# Altium project BMS_SLAVE.PrjPcb
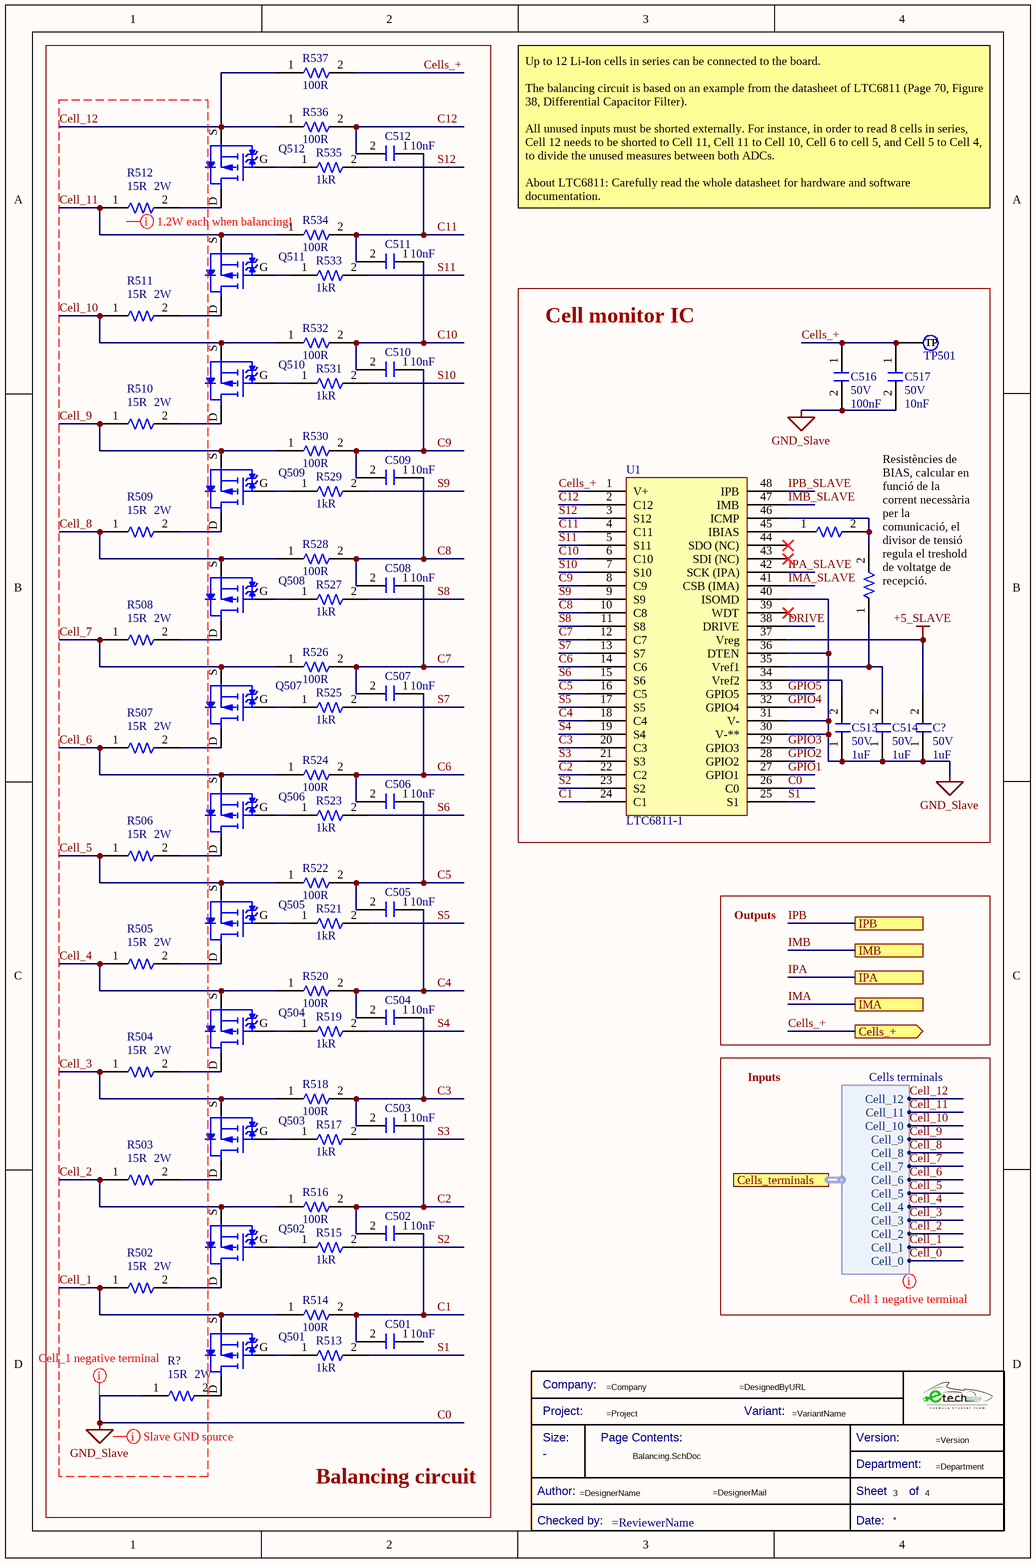
[diagram p0: Balancing.SchDoc]
2 sheets, 103 parts. Net scope: flat (ports and power ports of the same name join across sheets).
Sheets:
  Balancing.SchDoc
  Temperatures.SchDoc

## Sheet Balancing.SchDoc
size A4 portrait; DocumentNumber: 6; SheetNumber: 3; SheetTotal: 4

### Parts
(Parts that share a designator on the sheet are numbered #1, #2 ... from top to bottom, then left to right.)
*  Title Block_template  (value not drawn)  (graphical)
?#1  ERJ-8GEYJ112V  [R1206FTK-W]  (value not drawn)
?#2  ERJ-8GEYJ112V  [R1206FTK-W]  (value not drawn)
C501  Capacitance: 10nF  [C0805FNPC-R]  (hidden comment: 885012207092)
C502  Capacitance: 10nF  [C0805FNPC-R]  (hidden comment: 885012207092)
C503  Capacitance: 10nF  [C0805FNPC-R]  (hidden comment: 885012207092)
C504  Capacitance: 10nF  [C0805FNPC-R]  (hidden comment: 885012207092)
C505  Capacitance: 10nF  [C0805FNPC-R]  (hidden comment: 885012207092)
C506  Capacitance: 10nF  [C0805FNPC-R]  (hidden comment: 885012207092)
C507  Capacitance: 10nF  [C0805FNPC-R]  (hidden comment: 885012207092)
C508  Capacitance: 10nF  [C0805FNPC-R]  (hidden comment: 885012207092)
C509  Capacitance: 10nF  [C0805FNPC-R]  (hidden comment: 885012207092)
C510  Capacitance: 10nF  [C0805FNPC-R]  (hidden comment: 885012207092)
C511  Capacitance: 10nF  [C0805FNPC-R]  (hidden comment: 885012207092)
C512  Capacitance: 10nF  [C0805FNPC-R]  (hidden comment: 885012207092)
C513  Voltage Rating: 50V  Capacitance: 1uF  [C0805FNPC-R]  (hidden comment: 885012207103)
C514  Voltage Rating: 50V  Capacitance: 1uF  [C0805FNPC-R]  (hidden comment: 885012207103)
C516  Voltage Rating: 50V  Capacitance: 100nF  [C0805FNPC-R]  (hidden comment: 885012207098)
C517  Voltage Rating: 50V  Capacitance: 10nF  [C0805FNPC-R]  (hidden comment: 885012207092)
C?#1  Voltage Rating: 50V  Capacitance: 1uF  [C0805FNPC-R]  (hidden comment: 885012207103)
Q501  BSS308PE  [TRT-PCH-2/30-BSS]  (value not drawn)
Q502  BSS308PE  [TRT-PCH-2/30-BSS]  (value not drawn)
Q503  BSS308PE  [TRT-PCH-2/30-BSS]  (value not drawn)
Q504  BSS308PE  [TRT-PCH-2/30-BSS]  (value not drawn)
Q505  BSS308PE  [TRT-PCH-2/30-BSS]  (value not drawn)
Q506  BSS308PE  [TRT-PCH-2/30-BSS]  (value not drawn)
Q507  BSS308PE  [TRT-PCH-2/30-BSS]  (value not drawn)
Q508  BSS308PE  [TRT-PCH-2/30-BSS]  (value not drawn)
Q509  BSS308PE  [TRT-PCH-2/30-BSS]  (value not drawn)
Q510  BSS308PE  [TRT-PCH-2/30-BSS]  (value not drawn)
Q511  BSS308PE  [TRT-PCH-2/30-BSS]  (value not drawn)
Q512  BSS308PE  [TRT-PCH-2/30-BSS]  (value not drawn)
R502  value 15R  Max Power Dissipation: 2W  [R2512FTK]  (hidden comment: 352115RFT)
R503  value 15R  Max Power Dissipation: 2W  [R2512FTK]  (hidden comment: 352115RFT)
R504  value 15R  Max Power Dissipation: 2W  [R2512FTK]  (hidden comment: 352115RFT)
R505  value 15R  Max Power Dissipation: 2W  [R2512FTK]  (hidden comment: 352115RFT)
R506  value 15R  Max Power Dissipation: 2W  [R2512FTK]  (hidden comment: 352115RFT)
R507  value 15R  Max Power Dissipation: 2W  [R2512FTK]  (hidden comment: 352115RFT)
R508  value 15R  Max Power Dissipation: 2W  [R2512FTK]  (hidden comment: 352115RFT)
R509  value 15R  Max Power Dissipation: 2W  [R2512FTK]  (hidden comment: 352115RFT)
R510  value 15R  Max Power Dissipation: 2W  [R2512FTK]  (hidden comment: 352115RFT)
R511  value 15R  Max Power Dissipation: 2W  [R2512FTK]  (hidden comment: 352115RFT)
R512  value 15R  Max Power Dissipation: 2W  [R2512FTK]  (hidden comment: 352115RFT)
R513  Resistance: 1kR  [R0805FTK]  (hidden comment: CR0805-JW-102ELF)
R514  Resistance: 100R  [R0805FTK]  (hidden comment: CR0805-FX-1000ELF)
R515  Resistance: 1kR  [R0805FTK]  (hidden comment: CR0805-JW-102ELF)
R516  Resistance: 100R  [R0805FTK]  (hidden comment: CR0805-FX-1000ELF)
R517  Resistance: 1kR  [R0805FTK]  (hidden comment: CR0805-JW-102ELF)
R518  Resistance: 100R  [R0805FTK]  (hidden comment: CR0805-FX-1000ELF)
R519  Resistance: 1kR  [R0805FTK]  (hidden comment: CR0805-JW-102ELF)
R520  Resistance: 100R  [R0805FTK]  (hidden comment: CR0805-FX-1000ELF)
R521  Resistance: 1kR  [R0805FTK]  (hidden comment: CR0805-JW-102ELF)
R522  Resistance: 100R  [R0805FTK]  (hidden comment: CR0805-FX-1000ELF)
R523  Resistance: 1kR  [R0805FTK]  (hidden comment: CR0805-JW-102ELF)
R524  Resistance: 100R  [R0805FTK]  (hidden comment: CR0805-FX-1000ELF)
R525  Resistance: 1kR  [R0805FTK]  (hidden comment: CR0805-JW-102ELF)
R526  Resistance: 100R  [R0805FTK]  (hidden comment: CR0805-FX-1000ELF)
R527  Resistance: 1kR  [R0805FTK]  (hidden comment: CR0805-JW-102ELF)
R528  Resistance: 100R  [R0805FTK]  (hidden comment: CR0805-FX-1000ELF)
R529  Resistance: 1kR  [R0805FTK]  (hidden comment: CR0805-JW-102ELF)
R530  Resistance: 100R  [R0805FTK]  (hidden comment: CR0805-FX-1000ELF)
R531  Resistance: 1kR  [R0805FTK]  (hidden comment: CR0805-JW-102ELF)
R532  Resistance: 100R  [R0805FTK]  (hidden comment: CR0805-FX-1000ELF)
R533  Resistance: 1kR  [R0805FTK]  (hidden comment: CR0805-JW-102ELF)
R534  Resistance: 100R  [R0805FTK]  (hidden comment: CR0805-FX-1000ELF)
R535  Resistance: 1kR  [R0805FTK]  (hidden comment: CR0805-JW-102ELF)
R536  Resistance: 100R  [R0805FTK]  (hidden comment: CR0805-FX-1000ELF)
R537  Resistance: 100R  [R0805FTK]  (hidden comment: CR0805-FX-1000ELF)
R?#1  value 15R  Max Power Dissipation: 2W  [R2512FTK]  (hidden comment: 352115RFT)
TP501  TestPoint  [TestPoint]  (value not drawn)  (no BOM)
U1  LTC6811-1  [U_LTC6811G-2]

### Blocks framed on the sheet
Balancing circuit: C501-C512 Q501-Q512 R502-R537 R?#1
Cell monitor IC: ?#1 ?#2 C513 C514 C516 C517 C?#1 TP501 U1

### Ports
Cells_+ (out), Cells_terminals (harness Cells terminals), IMA, IMB, IPA, IPB

### Harnesses
Cells terminals: Cell_0, Cell_1, Cell_2, Cell_3, Cell_4, Cell_5, Cell_6, Cell_7, Cell_8, Cell_9, Cell_10, Cell_11, Cell_12

### Nets
+5_SLAVE: C?#1.2 U1.37(Vreg)
C0: C513.1 C514.1 C516.2 C517.2 C?#1.1 R?#1.1 U1.26(C0) U1.30(V-**) U1.31(V-) U1.36(DTEN) U1.40(ISOMD)  [also labelled GND_Slave]
C1: C501.2 C502.1 R514.2 U1.24(C1)
C2: C502.2 C503.1 R516.2 U1.22(C2)
C3: C503.2 C504.1 R518.2 U1.20(C3)
C4: C504.2 C505.1 R520.2 U1.18(C4)
C5: C505.2 C506.1 R522.2 U1.16(C5)
C6: C506.2 C507.1 R524.2 U1.14(C6)
C7: C507.2 C508.1 R526.2 U1.12(C7)
C8: C508.2 C509.1 R528.2 U1.10(C8)
C9: C509.2 C510.1 R530.2 U1.8(C9)
C10: C510.2 C511.1 R532.2 U1.6(C10)
C11: C511.2 C512.1 R534.2 U1.4(C11)
C12: C512.2 R536.2 U1.2(C12)
Cell_0: port Cells_terminals.Cell_0
Cell_1: Q501.S R502.1 R514.1 ; port Cells_terminals.Cell_1
Cell_2: Q502.S R503.1 R516.1 ; port Cells_terminals.Cell_2
Cell_3: Q503.S R504.1 R518.1 ; port Cells_terminals.Cell_3
Cell_4: Q504.S R505.1 R520.1 ; port Cells_terminals.Cell_4
Cell_5: Q505.S R506.1 R522.1 ; port Cells_terminals.Cell_5
Cell_6: Q506.S R507.1 R524.1 ; port Cells_terminals.Cell_6
Cell_7: Q507.S R508.1 R526.1 ; port Cells_terminals.Cell_7
Cell_8: Q508.S R509.1 R528.1 ; port Cells_terminals.Cell_8
Cell_9: Q509.S R510.1 R530.1 ; port Cells_terminals.Cell_9
Cell_10: Q510.S R511.1 R532.1 ; port Cells_terminals.Cell_10
Cell_11: Q511.S R512.1 R534.1 ; port Cells_terminals.Cell_11
Cell_12: Q512.S R536.1 R537.1 ; port Cells_terminals.Cell_12
Cells_+: C516.1 C517.1 R537.2 TP501.1(TP) U1.1(V+) ; port Cells_+
DRIVE: U1.38(DRIVE)
GPIO1: U1.27(GPIO1)
GPIO2: U1.28(GPIO2)
GPIO3: U1.29(GPIO3)
GPIO4: U1.32(GPIO4)
GPIO5: U1.33(GPIO5)
IMA: port IMA
IMA_SLAVE: U1.41(CSB_(IMA))
IMB: port IMB
IMB_SLAVE: U1.47(IMB)
IPA: port IPA
IPA_SLAVE: U1.42(SCK_(IPA))
IPB: port IPB
IPB_SLAVE: U1.48(IPB)
S1: R513.2 U1.25(S1)
S2: R515.2 U1.23(S2)
S3: R517.2 U1.21(S3)
S4: R519.2 U1.19(S4)
S5: R521.2 U1.17(S5)
S6: R523.2 U1.15(S6)
S7: R525.2 U1.13(S7)
S8: R527.2 U1.11(S8)
S9: R529.2 U1.9(S9)
S10: R531.2 U1.7(S10)
S11: R533.2 U1.5(S11)
S12: R535.2 U1.3(S12)
Net?#1_1: ?#1.1 U1.45(IBIAS)
Net?#1_2: ?#1.2 ?#2.2 U1.46(ICMP)
Net?#2_1: ?#2.1 C514.2 U1.35(Vref1)
NetC513_2: C513.2 U1.34(Vref2)
NetQ501_D: Q501.D R?#1.2
NetQ501_G: Q501.G R513.1
NetQ502_D: Q502.D R502.2
NetQ502_G: Q502.G R515.1
NetQ503_D: Q503.D R503.2
NetQ503_G: Q503.G R517.1
NetQ504_D: Q504.D R504.2
NetQ504_G: Q504.G R519.1
NetQ505_D: Q505.D R505.2
NetQ505_G: Q505.G R521.1
NetQ506_D: Q506.D R506.2
NetQ506_G: Q506.G R523.1
NetQ507_D: Q507.D R507.2
NetQ507_G: Q507.G R525.1
NetQ508_D: Q508.D R508.2
NetQ508_G: Q508.G R527.1
NetQ509_D: Q509.D R509.2
NetQ509_G: Q509.G R529.1
NetQ510_D: Q510.D R510.2
NetQ510_G: Q510.G R531.1
NetQ511_D: Q511.D R511.2
NetQ511_G: Q511.G R533.1
NetQ512_D: Q512.D R512.2
NetQ512_G: Q512.G R535.1

Not connected (* = marked no-connect by the designer): C501 1; U1 39(WDT)* 43(SDI_(NC))* 44(SDO_(NC))*

### Layout directives
mark named Cell 1 negative terminal: Cell_0
mark named Slave GND source: Cell_1, Cell_2, Cell_3, Cell_4, Cell_5, Cell_6, Cell_7, Cell_8, Cell_9, Cell_10, Cell_11, Cell_12, GND_Slave
mark named 1.2W each when balancing!: Cell_1, Cell_2, Cell_3, Cell_4, Cell_5, Cell_6, Cell_7, Cell_8, Cell_9, Cell_10, Cell_11, Cell_12, GND_Slave
mark named Cell_1 negative terminal: C0

### Notes on the sheet
- Up to 12 Li-Ion cells in series can be connected to the board.
  The balancing circuit is based on an example from the datasheet of LTC6811 (Page 70, Figure 38, Differential Capacitor Filter).
  All unused inputs must be shorted externally. For instance, in order to read 8 cells in series, Cell 12 needs to be shorted to Cell 11, Cell 11 to Cell 10, Cell 6 to cell 5, and Cell 5 to Cell 4, to divide the unused measures between both ADCs.
  About LTC6811: Carefully read the whole datasheet for hardware and software documentation.
- Resistències de BIAS, calcular en funció de la corrent necessària per la comunicació, el divisor de tensió regula el treshold de voltatge de recepció.
- Outputs
- Inputs
- Title
- Size:
- Date:
- A4
- Number:
- Time:
- Revision:
- Sheet
- of
- File:
- (in symbol Title Block_template) Company:; Project:; Variant:; Size:; Page Contents:; Version:; Department:; Author:; Sheet; of; Checked by:; Date:

### Library data of the parts
* = Title Block_template: Standard Title Block; Category: Title Block; Checked by:: =ReviewerName; Size: -
?#1 ?#2 = R1k1-1206FTK: Res Thick Film 1206 1.1K Ohm 5% 0.25W ±200ppm/°C Molded SMD Punched Carrier T/R; Manufacturer: Panasonic; Power Rating: 250mW; Voltage Rating: 200V; .Creator: DO; Supplier 1: Newark; Manufacturer Part Number: ERJ-8GEYJ112V; RoHS: Yes; Category: Chip SMD Resistors; Stock 1: 9980; Pricing 1: 10=0,12700, 25=0,10100, 50=0,07500, 100=0,05000 (USD); Mount: Surface Mount; Case/Package: 1206; Contact Plating: Tin; Case Code (Metric): 3216; Case Code (Imperial): 1206; Min Operating Temperature: -55°C; Max Operating Temperature: 155°C; Tolerance: 5%; Resistor Type: Thick Film; Temperature Coefficient: 200ppm/°C; Packaging: Tape and Reel; Package Quantity: 1; Number of Terminations: 2; Max Power Dissipation: 250mW; Voltage Rating (DC): 200V; Features: Automotive AEC-Q200; Series: ERJ; Resistance Tolerance: 5%; Construction: Rectangular; Length: 3.2mm; Width: 0.063inch; Height: 0.028inch; Depth: 1.6mm; Radiation Hardening: No; REACH SVHC: No SVHC; Military Standard: Not; Lead Free: Lead Free; RoHS Compliant: Yes; ComponentLink1URL: https://datasheet.ciiva.com/5868/1500035-5868231.pdf?src-supplier=Farnell; ComponentLink1Description: https://datasheet.ciiva.com/5868/1500035-5868231.pdf?src-supplier=Farnell; ComponentLink2URL: https://datasheet.ciiva.com/17215/aoa0000ce1-17215127.pdf?src-supplier=Avnet+Europe; ComponentLink2Description: https://datasheet.ciiva.com/17215/aoa0000ce1-17215127.pdf?src-supplier=Avnet+Europe; ComponentLink3URL: https://datasheet.ciiva.com/46387/1500035-46387306.pdf?src-supplier=Element14; ComponentLink3Description: https://datasheet.ciiva.com/46387/1500035-46387306.pdf?src-supplier=Element14; ComponentLink4URL: https://datasheet.ciiva.com/9198/aoa0000ce1-9198847.pdf?src-supplier=Avnet; ComponentLink4Description: https://datasheet.ciiva.com/9198/aoa0000ce1-9198847.pdf?src-supplier=Avnet; Supplier Part Number 1: 63W1481; ComponentLink5Description: Where buy it; ComponentLink5URL: https://www.mouser.es/ProductDetail/Panasonic/ERJ-8GEYJ112V?qs=1VWA5LkbEaqqGx1BXqOkLA%3D%3D
C501-C512 C517 = C10n-50V-0805FNPC-X7R: Cap, 0.01ΜF, 50V, 10%, X7R, 0805; Manufacturer 1: Wurth Electronics; .Creator: DR; Supplier 1: RSComponents; Manufacturer Part Number 1: 885012207092; RoHS: Yes; Category: Ceramic Capacitors; Stock 1: 1; Pricing 1: 4000=0,03200, 12000=0,03100 (USD); Mount: Surface Mount; Case/Package: 0805; Case Code (Metric): 2012; Case Code (Imperial): 0805; Min Operating Temperature: -55°C; Max Operating Temperature: 125°C; Packaging: Cut Tape; Dielectric: X7R; Tolerance: 10%; Voltage Rating (DC): 50V; Length: 0.079inch; Width: 0.049inch; Thickness: 0.035inch; REACH SVHC: Unknown; RoHS Compliant: Yes; ComponentLink1URL: http://www.farnell.com/datasheets/1958497.pdf?src-supplier=Farnell; ComponentLink1Description: http://www.farnell.com/datasheets/1958497.pdf?src-supplier=Farnell; ComponentLink2URL: http://www.farnell.com/datasheets/1958497.pdf?src-supplier=Element14; ComponentLink2Description: http://www.farnell.com/datasheets/1958497.pdf?src-supplier=Element14; ComponentLink3URL: http://www.farnell.com/datasheets/1958497.pdf?src-supplier=Newark; ComponentLink3Description: http://www.farnell.com/datasheets/1958497.pdf?src-supplier=Newark; ComponentLink4URL: https://katalog.we-online.de/pbs/datasheet/885012207092.pdf?src-supplier=Digi-Key; ComponentLink4Description: https://katalog.we-online.de/pbs/datasheet/885012207092.pdf?src-supplier=Digi-Key; Supplier Part Number 1: 1813941
  C501-C512: Voltage Rating: 50V
C513 C514 C?#1 = C1u-50V-0805FNPC-X7R: Multilayer Ceramic Capacitor, Wcap-Csgp Series, 1 F, 10%, X7R, 50 V, 0805 [2012 Metric] Rohs Compliant: Yes; Manufacturer 1: Wurth Electronics; .Creator: GP; Supplier 1: RSComponents; Manufacturer Part Number 1: 885012207103; RoHS: Yes; Category: Ceramic Capacitors; Stock 1: 5100; Pricing 1: 50=0,27200, 250=0,25300, 500=0,22800, 1250=0,20100, 2500=0,17100 (GBP); Mount: Surface Mount; Case/Package: 0805; Case Code (Metric): 2012; Case Code (Imperial): 0805; Min Operating Temperature: -55°C; Max Operating Temperature: 85°C; Packaging: Cut Tape; Dielectric: X7R; Tolerance: 10%; Voltage Rating (DC): 50V; Length: 0.079inch; Width: 0.049inch; Thickness: 0.053inch; REACH SVHC: Unknown; RoHS Compliant: Yes; ComponentLink1URL: http://www.farnell.com/datasheets/1958501.pdf?src-supplier=Farnell; ComponentLink1Description: http://www.farnell.com/datasheets/1958501.pdf?src-supplier=Farnell; ComponentLink2URL: http://www.farnell.com/datasheets/1958501.pdf?src-supplier=Element14; ComponentLink2Description: http://www.farnell.com/datasheets/1958501.pdf?src-supplier=Element14; ComponentLink3URL: https://katalog.we-online.de/pbs/datasheet/885012107003.pdf?src-supplier=Digi-Key; ComponentLink3Description: https://katalog.we-online.de/pbs/datasheet/885012107003.pdf?src-supplier=Digi-Key; ComponentLink4URL: http://www.farnell.com/datasheets/1958501.pdf?src-supplier=Newark; ComponentLink4Description: http://www.farnell.com/datasheets/1958501.pdf?src-supplier=Newark; Supplier Part Number 1: 1813523
C516 = C100n-50V-0805FNPC-X7R: Cap, 0.1ΜF, 50V, 10%, X7R, 0805; Manufacturer 1: Wurth Electronics; .Creator: DR; Supplier 1: RSComponents; Manufacturer Part Number 1: 885012207098; RoHS: Yes; Category: Ceramic Capacitors; Stock 1: 8000; Pricing 1: 100=0,10200, 500=0,07100, 2000=0,06100 (GBP); Mount: Surface Mount; Case/Package: 0805; Case Code (Metric): 2012; Case Code (Imperial): 0805; Min Operating Temperature: -55°C; Max Operating Temperature: 125°C; Packaging: Cut Tape; Dielectric: X7R; Tolerance: 10%; Voltage Rating (DC): 50V; Length: 0.079inch; Width: 0.049inch; Thickness: 0.035inch; REACH SVHC: Unknown; RoHS Compliant: Yes; ComponentLink1URL: http://www.farnell.com/datasheets/1958498.pdf?src-supplier=Farnell; ComponentLink1Description: http://www.farnell.com/datasheets/1958498.pdf?src-supplier=Farnell; ComponentLink2URL: http://www.farnell.com/datasheets/1958498.pdf?src-supplier=Element14; ComponentLink2Description: http://www.farnell.com/datasheets/1958498.pdf?src-supplier=Element14; ComponentLink3URL: https://katalog.we-online.de/pbs/datasheet/885012207098.pdf?src-supplier=Digi-Key; ComponentLink3Description: https://katalog.we-online.de/pbs/datasheet/885012207098.pdf?src-supplier=Digi-Key; ComponentLink4URL: http://www.farnell.com/datasheets/1958498.pdf?src-supplier=Newark; ComponentLink4Description: http://www.farnell.com/datasheets/1958498.pdf?src-supplier=Newark; Supplier Part Number 1: 1813493
Q501-Q512 = TRT-PCH-2/30-BSS: Infineon’s highly innovative OptiMOS™ families include p-channel power MOSFETs, SOT-23-3, RoHS; Manufacturer Part Number: BSS308PEH6327; Continuous Drain Current (ID): 2A; Input Capacitance: 500pF; Drain to Source Voltage (Vdss): 30V; Max Power Dissipation: 500mW; Gate to Source Voltage (Vgs): 20V; Rds On Max: 80mR; Rise Time: 7.7ns; Turn-Off Delay Time: 15.3ns; Fall Time: 2.8ns; Turn-On Delay Time: 5.6ns; Threshold Voltage: -1.5V; .Creator: DO; Supplier 1: RSComponents; Manufacturer: Infineon; RoHS: Yes; Category: MOSFETs; Stock 1: 4000; Pricing 1: 50=0,50300, 100=0,26400, 250=0,25900, 500=0,25200, 1000=0,24700 (USD); Mount: Surface Mount; Case/Package: TO-236-3; Number of Pins: 3; Min Operating Temperature: -55°C; Max Operating Temperature: 150°C; Packaging: Tape and Reel; Package Quantity: 1; Series: OptiMOS™; REACH SVHC: No SVHC; ComponentLink1URL: https://datasheet.ciiva.com/6379/infineon-bss308pe-ds-v02-03-en-6379920.pdf?src-supplier=Digi-Key; ComponentLink1Description: datasheet; ComponentLink2URL: https://datasheet.ciiva.com/11171/infineon-bss308pe-ds-v02-03-en-11171385.pdf?src-supplier=Avnet; ComponentLink2Description: https://datasheet.ciiva.com/11171/infineon-bss308pe-ds-v02-03-en-11171385.pdf?src-supplier=Avnet; Supplier Part Number 1: 8235500
R502-R512 R?#1 = R15-2512FTK: Res Thick Film 2512 15 Ohm 1% 2W ±100ppm/C Pad SMD T/R; Manufacturer 1: TE Connectivity; Temperature Coefficient: 100ppm/°C; Voltage Rating: 250V; Number of Resistors: 1; .Creator: DR; ComponentLink1Description: Datasheet; ComponentLink1URL: https://docs.rs-online.com/8bc1/0900766b81096b90.pdf; ComponentLink2Description: Where buy it; ComponentLink2URL: https://es.rs-online.com/web/p/resistencias-de-montaje-en-superficie/7551110; Supplier 1: RSComponents; Manufacturer Part Number 1: 352115RFT; RoHS: Yes; Category: Chip SMD Resistors; Stock 1: 1; Pricing 1: 10=0,64300, 250=0,62200, 1000=0,60000, 2000=0,55400, 2500=0,52100 (USD); Mount: Surface Mount; Case/Package: 2512; Case Code (Metric): 6432; Case Code (Imperial): 2512; Min Operating Temperature: -55°C; Max Operating Temperature: 155°C; Packaging: Tape and Reel; Tolerance: 1%; Resistor Type: Thick Film,Power resistor; Number of Terminations: 2; Termination: Solder; Voltage Rating (DC): 250V; Features: Automotive AEC-Q200; Series: 3521, CGS; Technology: THICK FILM; Resistance Tolerance: 1%; Length: 6.3mm; Height: 0.55mm; Depth: 3.2mm; RoHS Compliant: Yes; REACH SVHC: No SVHC; ELV: Compliant; ComponentLink3URL: https://datasheet.ciiva.com/25610/0900766b81096b90-25610033.pdf?src-supplier=RSComponents; ComponentLink3Description: https://datasheet.ciiva.com/25610/0900766b81096b90-25610033.pdf?src-supplier=RSComponents; ComponentLink4URL: https://datasheet.ciiva.com/46391/1610601-46391493.pdf?src-supplier=Element14; ComponentLink4Description: https://datasheet.ciiva.com/46391/1610601-46391493.pdf?src-supplier=Element14; ComponentLink5URL: https://datasheet.ciiva.com/7657/1610601-7657542.pdf?src-supplier=Element14; ComponentLink5Description: https://datasheet.ciiva.com/7657/1610601-7657542.pdf?src-supplier=Element14; Supplier Part Number 1: 7551110P
R513 R515 R517 R519 R521 R523 R525 R527 R529 R531 R533 R535 = R1k-0805FTK: Res Thick Film 0805 1K Ohm 5% 1/8W ±200ppm/°C Molded SMD SMD Paper Tape on Plastic Reel; Manufacturer 1: Bourns; Voltage Rating (DC): 150V; Power Rating: 125mW; .Creator: GP; Supplier 1: Arrow Electronics; Manufacturer Part Number 1: CR0805-JW-102ELF; RoHS: Yes; Category: Chip SMD Resistors; Stock 1: 27510; Pricing 1: 1=0,05930, 10=0,03510, 25=0,01790, 100=0,00800, 250=0,00790, 500=0,00590, 1000=0,00360, 3000=0,00350, 6000=0,00250 (USD); Mount: Surface Mount; Case/Package: 0805; Number of Pins: 2; Contact Plating: Tin; Case Code (Metric): 2012; Case Code (Imperial): 0805; Min Operating Temperature: -55°C; Max Operating Temperature: 155°C; Resistor Type: Thick Film; Tolerance: 5%; Temperature Coefficient: 200ppm/°C; Features: Moisture Resistant; Package Quantity: 1; Packaging: Tape and Reel; Voltage Rating: 150V; Number of Terminations: 2; Termination: SMD/SMT; Max Power Dissipation: 125mW; Length: 2mm; Width: 1.25mm; Height: 0.5mm; Thickness: 508um; Depth: 1.25mm; Radiation Hardening: No; Lead Free: Lead Free; REACH SVHC: No SVHC; Military Standard: Not; ComponentLink1URL: https://datasheet.ciiva.com/11821/0900766b80fcdb72-11821134.pdf?src-supplier=RSComponents; ComponentLink1Description: https://datasheet.ciiva.com/11821/0900766b80fcdb72-11821134.pdf?src-supplier=RSComponents; ComponentLink2URL: https://datasheet.ciiva.com/15225/getdatasheetpartid-78155-15225381.pdf?src-supplier=Verical; ComponentLink2Description: https://datasheet.ciiva.com/15225/getdatasheetpartid-78155-15225381.pdf?src-supplier=Verical; ComponentLink3URL: https://datasheet.ciiva.com/22693/1902866-22693253.pdf?src-supplier=Element14; ComponentLink3Description: https://datasheet.ciiva.com/22693/1902866-22693253.pdf?src-supplier=Element14; ComponentLink4URL: https://datasheet.ciiva.com/7986/1856384-7986184.pdf?src-supplier=Element14; ComponentLink4Description: https://datasheet.ciiva.com/7986/1856384-7986184.pdf?src-supplier=Element14; ComponentLink5URL: https://datasheet.ciiva.com/7985/1856384-7985867.pdf?src-supplier=Element14; ComponentLink5Description: https://datasheet.ciiva.com/7985/1856384-7985867.pdf?src-supplier=Element14; ComponentLink6URL: https://datasheet.ciiva.com/30242/159chpreztr-30242765.pdf?src-supplier=Onlinecomponents.com; ComponentLink6Description: https://datasheet.ciiva.com/30242/159chpreztr-30242765.pdf?src-supplier=Onlinecomponents.com; ComponentLink7URL: https://datasheet.ciiva.com/6547/chpreztr-6547359.pdf?src-supplier=Digi-Key; ComponentLink7Description: https://datasheet.ciiva.com/6547/chpreztr-6547359.pdf?src-supplier=Digi-Key; Supplier Part Number 1: CR0805-JW-102ELF
R514 R516 R518 R520 R522 R524 R526 R528 R530 R532 R534 R536 R537 = R100-0805FTK: Res Thick Film 0805 100 Ohm 1% 1/8W ±100ppm/°C Molded SMD SMD Paper Tape on Plastic Reel; Manufacturer 1: Bourns; Power Rating: 125mW; Voltage Rating: 150V; .Creator: DR; Supplier 1: Arrow Electronics; Manufacturer Part Number 1: CR0805-FX-1000ELF; RoHS: Yes; Category: Chip SMD Resistors; Stock 1: 49802; Pricing 1: 1=0,05840, 10=0,03430, 25=0,01780, 100=0,00750, 250=0,00560, 500=0,00490, 3000=0,00470 (USD); Mount: Surface Mount; Case/Package: 0805; Number of Pins: 2; Contact Plating: Tin; Case Code (Imperial): 0805; Case Code (Metric): 2012; Min Operating Temperature: -55°C; Max Operating Temperature: 155°C; Tolerance: 1%; Resistor Type: Thick Film; Temperature Coefficient: 100ppm/°C; Packaging: Tape and Reel; Package Quantity: 1; Termination: SMD/SMT; Number of Terminations: 2; Max Power Dissipation: 125mW; Voltage Rating (DC): 150V; Features: Moisture Resistant; Series: CR0805; Resistance Tolerance: 1%; Construction: Rectangular; Technology: THICK FILM; Length: 2mm; Width: 1.25mm; Height: 0.5mm; Depth: 1.25mm; Thickness: 508um; Radiation Hardening: No; REACH SVHC: No SVHC; Military Standard: Not; RoHS Compliant: Yes; ComponentLink1URL: https://datasheet.ciiva.com/11809/0900766b80fcdb72-11809178.pdf?src-supplier=RSComponents; ComponentLink1Description: https://datasheet.ciiva.com/11809/0900766b80fcdb72-11809178.pdf?src-supplier=RSComponents; ComponentLink2URL: https://datasheet.ciiva.com/6547/chpreztr-6547413.pdf?src-supplier=Digi-Key; ComponentLink2Description: https://datasheet.ciiva.com/6547/chpreztr-6547413.pdf?src-supplier=Digi-Key; ComponentLink3URL: https://datasheet.ciiva.com/6547/chpreztr-6547414.pdf?src-supplier=Digi-Key; ComponentLink3Description: https://datasheet.ciiva.com/6547/chpreztr-6547414.pdf?src-supplier=Digi-Key; ComponentLink4URL: https://datasheet.ciiva.com/6547/chpreztr-6547415.pdf?src-supplier=Digi-Key; ComponentLink4Description: https://datasheet.ciiva.com/6547/chpreztr-6547415.pdf?src-supplier=Digi-Key; ComponentLink5URL: https://datasheet.ciiva.com/9120/chpreztr-9120744.pdf?src-supplier=Avnet; ComponentLink5Description: https://datasheet.ciiva.com/9120/chpreztr-9120744.pdf?src-supplier=Avnet; Supplier Part Number 1: CR0805-FX-1000ELF
TP501 = TestPoint: Test Point 1x1 mm; .Creator: GP; Category: TestPoint; .PCBcheck: GP; .SCHcheck: GP
U1 = U_LTC6811-1: Sc-Automotive Multicell Battery Stack Monitor With Addressable Isospi Interface; Manufacturer 1: Analog Devices; .Creator: GP; ComponentLink1URL: https://www.analog.com/media/en/technical-documentation/data-sheets/ltc6811-1-6811-2.pdf; ComponentLink1Description: Datasheet; ComponentLink2Description: Where buy it; ComponentLink2URL: https://www.mouser.es/ProductDetail/Analog-Devices/LTC6811IG-23ZZTRPBF?qs=byeeYqUIh0NWJgxDt7RX5g%3D%3D; Supplier 1: Digi-Key; Category: Battery Management; Pricing 1: 1=21,46000, 10=19,72200, 25=18,90400, 100=16,65600, 250=15,90600 (USD); RoHS Compliant: Yes; ComponentLink3URL: http://www.linear.com/docs/55980?src-supplier=Digi-Key; ComponentLink3Description: http://www.linear.com/docs/55980?src-supplier=Digi-Key; ComponentLink4URL: https://datasheet.octopart.com/LTC6811HG-1%23PBF-Analog-Devices-datasheet-138896417.pdf?src-supplier=Upverter; ComponentLink4Description: https://datasheet.octopart.com/LTC6811HG-1%23PBF-Analog-Devices-datasheet-138896417.pdf?src-supplier=Upverter; ComponentLink5URL: https://datasheet.octopart.com/LTC6811HG-1%23PBF-Linear-Technology-datasheet-66874450.pdf?src-supplier=Linear+Technology; ComponentLink5Description: https://datasheet.octopart.com/LTC6811HG-1%23PBF-Linear-Technology-datasheet-66874450.pdf?src-supplier=Linear+Technology; ComponentLink6URL: https://sigma.octopart.com/57702806/technical_drawing/Linear-Technology-LTC6811HG-1%23PBF.pdf?src-supplier=Linear+Technology; ComponentLink6Description: https://sigma.octopart.com/57702806/technical_drawing/Linear-Technology-LTC6811HG-1%23PBF.pdf?src-supplier=Linear+Technology; Supplier Part Number 1: 505-LTC6811HG-1#PBF-ND; Case/Package: SSOP; Manufacturer Part Number 1: LTC6811-1

## Sheet Temperatures.SchDoc
size A4; SheetNumber: 4; SheetTotal: 5
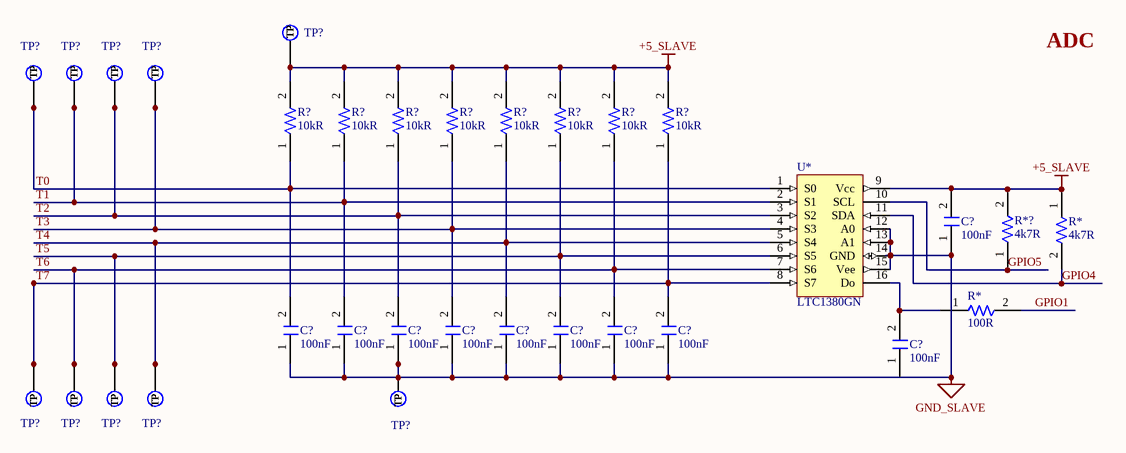
[diagram p1: Temperatures.SchDoc]

### Parts
(Parts that share a designator on the sheet are numbered #1, #2 ... from top to bottom, then left to right.)
C?#2  Capacitance: 100nF  [C0805FNPC-R]  (hidden comment: 885012207098)
C?#3  Capacitance: 100nF  [C0805FNPC-R]  (hidden comment: 885012207098)
C?#4  Capacitance: 100nF  [C0805FNPC-R]  (hidden comment: 885012207098)
C?#5  Capacitance: 100nF  [C0805FNPC-R]  (hidden comment: 885012207098)
C?#6  Capacitance: 100nF  [C0805FNPC-R]  (hidden comment: 885012207098)
C?#7  Capacitance: 100nF  [C0805FNPC-R]  (hidden comment: 885012207098)
C?#8  Capacitance: 100nF  [C0805FNPC-R]  (hidden comment: 885012207098)
C?#9  Capacitance: 100nF  [C0805FNPC-R]  (hidden comment: 885012207098)
C?#10  Capacitance: 100nF  [C0805FNPC-R]  (hidden comment: 885012207098)
C?#11  Capacitance: 100nF  [C0805FNPC-R]  (hidden comment: 885012207098)
R*#1  Resistance: 4k7R  [R0805FTK]  (hidden comment: CR0805-JW-472ELF)
R*#2  Resistance: 100R  [R0805FTK]  (hidden comment: CR0805-FX-1000ELF)
R*?  Resistance: 4k7R  [R0805FTK]  (hidden comment: CR0805-JW-472ELF)
R?#2  Resistance: 10kR  [R0805FTK]  (hidden comment: CR0805-JW-103ELF)
R?#3  Resistance: 10kR  [R0805FTK]  (hidden comment: CR0805-JW-103ELF)
R?#4  Resistance: 10kR  [R0805FTK]  (hidden comment: CR0805-JW-103ELF)
R?#5  Resistance: 10kR  [R0805FTK]  (hidden comment: CR0805-JW-103ELF)
R?#6  Resistance: 10kR  [R0805FTK]  (hidden comment: CR0805-JW-103ELF)
R?#7  Resistance: 10kR  [R0805FTK]  (hidden comment: CR0805-JW-103ELF)
R?#8  Resistance: 10kR  [R0805FTK]  (hidden comment: CR0805-JW-103ELF)
R?#9  Resistance: 10kR  [R0805FTK]  (hidden comment: CR0805-JW-103ELF)
TP?#1  TestPoint  [TestPoint]  (value not drawn)  (no BOM)
TP?#2  TestPoint  [TestPoint]  (value not drawn)  (no BOM)
TP?#3  TestPoint  [TestPoint]  (value not drawn)  (no BOM)
TP?#4  TestPoint  [TestPoint]  (value not drawn)  (no BOM)
TP?#5  TestPoint  [TestPoint]  (value not drawn)  (no BOM)
TP?#6  TestPoint  [TestPoint]  (value not drawn)  (no BOM)
TP?#7  TestPoint  [TestPoint]  (value not drawn)  (no BOM)
TP?#8  TestPoint  [TestPoint]  (value not drawn)  (no BOM)
TP?#9  TestPoint  [TestPoint]  (value not drawn)  (no BOM)
TP?#10  TestPoint  [TestPoint]  (value not drawn)  (no BOM)
U*  LTC1380GN  [LTC1380GN]

### Nets
+5_SLAVE: C?#2.2 R*#1.1 R*?.2 R?#2.2 R?#3.2 R?#4.2 R?#5.2 R?#6.2 R?#7.2 R?#8.2 R?#9.2 TP?#1.1(TP) U*.9(Vcc)
GND_SLAVE: C?#2.1 C?#3.1 C?#4.1 C?#5.1 C?#6.1 C?#7.1 C?#8.1 C?#9.1 C?#10.1 C?#11.1 TP?#10.1(TP) U*.12(A0) U*.13(A1) U*.14(GND) U*.15(Vee)  [project net C0]
GPIO1: R*#2.2
GPIO4: R*#1.2 U*.11(SDA)
GPIO5: R*?.1 U*.10(SCL)
T0: C?#3.2 R?#2.1 TP?#2.1(TP) U*.1(S0)
T1: C?#4.2 R?#3.1 TP?#3.1(TP) U*.2(S1)
T2: C?#5.2 R?#4.1 TP?#4.1(TP) U*.3(S2)
T3: C?#6.2 R?#5.1 TP?#5.1(TP) U*.4(S3)
T4: C?#7.2 R?#6.1 TP?#9.1(TP) U*.5(S4)
T5: C?#8.2 R?#7.1 TP?#8.1(TP) U*.6(S5)
T6: C?#9.2 R?#8.1 TP?#7.1(TP) U*.7(S6)
T7: C?#10.2 R?#9.1 TP?#6.1(TP) U*.8(S7)
NetC?#11_2: C?#11.2 R*#2.1 U*.16(Do)

### Notes on the sheet
- ADC

### Library data of the parts
C?#2-C?#11 = C100n-50V-0805FNPC-X7R: as C516 on sheet Balancing; Supplier 1: RSComponents; Manufacturer Part Number 1: 885012207098; RoHS: Yes; Category: Ceramic Capacitors; Stock 1: 8000; Pricing 1: 100=0,10200, 500=0,07100, 2000=0,06100 (GBP); Mount: Surface Mount; Case/Package: 0805; Case Code (Metric): 2012; Case Code (Imperial): 0805; Min Operating Temperature: -55°C; Max Operating Temperature: 125°C; Packaging: Cut Tape; Voltage Rating: 50V; Dielectric: X7R; Tolerance: 10%; Voltage Rating (DC): 50V; Length: 0.079inch; Width: 0.049inch; Thickness: 0.035inch; REACH SVHC: Unknown; RoHS Compliant: Yes; ComponentLink1URL: http://www.farnell.com/datasheets/1958498.pdf?src-supplier=Farnell; ComponentLink1Description: http://www.farnell.com/datasheets/1958498.pdf?src-supplier=Farnell; ComponentLink2URL: http://www.farnell.com/datasheets/1958498.pdf?src-supplier=Element14; ComponentLink2Description: http://www.farnell.com/datasheets/1958498.pdf?src-supplier=Element14; ComponentLink3URL: https://katalog.we-online.de/pbs/datasheet/885012207098.pdf?src-supplier=Digi-Key; ComponentLink3Description: https://katalog.we-online.de/pbs/datasheet/885012207098.pdf?src-supplier=Digi-Key; ComponentLink4URL: http://www.farnell.com/datasheets/1958498.pdf?src-supplier=Newark; ComponentLink4Description: http://www.farnell.com/datasheets/1958498.pdf?src-supplier=Newark; Supplier Part Number 1: 1813493
R*#1 R*? = R4.7K-0805FTK: Res Thick Film 0805 4.7K Ohm 5% 1/8W ±200ppm/°C Molded SMD SMD Paper Tape on Plastic Reel; Manufacturer 1: Bourns; Power Rating: 125mW; Voltage Rating: 150V; .Creator: DR; Supplier 1: Arrow Electronics; Manufacturer Part Number 1: CR0805-JW-472ELF; RoHS: Yes; Category: Chip SMD Resistors; Stock 1: 3734; Pricing 1: 1=0,05590, 10=0,01670, 25=0,01290, 100=0,00840, 250=0,00830, 500=0,00690, 1000=0,00410 (USD); Mount: Surface Mount; Case/Package: 0805; Case Code (Metric): 2012; Case Code (Imperial): 0805; Contact Plating: Tin; Min Operating Temperature: -55°C; Max Operating Temperature: 155°C; Packaging: Tape and Reel; Tolerance: 5%; Package Quantity: 1; Resistor Type: Thick Film; Number of Terminations: 2; Termination: SMD/SMT; Temperature Coefficient: 200ppm/°C; Max Power Dissipation: 125mW; Voltage Rating (DC): 150V; Features: Moisture Resistant; Series: CR0805; Resistance Tolerance: 5%; Construction: Rectangular; Length: 2mm; Width: 0.049inch; Height: 0.024inch; Depth: 1.25mm; Thickness: 508um; Radiation Hardening: No; REACH SVHC: No SVHC; Military Standard: Not; RoHS Compliant: Yes; ComponentLink1URL: https://datasheet.ciiva.com/5541/chpreztr-5541593.pdf?src-supplier=Mouser; ComponentLink1Description: https://datasheet.ciiva.com/5541/chpreztr-5541593.pdf?src-supplier=Mouser; ComponentLink2URL: https://datasheet.ciiva.com/6560/chpreztr-6560073.pdf?src-supplier=Digi-Key; ComponentLink2Description: https://datasheet.ciiva.com/6560/chpreztr-6560073.pdf?src-supplier=Digi-Key; ComponentLink3URL: https://datasheet.ciiva.com/6560/chpreztr-6560074.pdf?src-supplier=Digi-Key; ComponentLink3Description: https://datasheet.ciiva.com/6560/chpreztr-6560074.pdf?src-supplier=Digi-Key; ComponentLink4URL: https://datasheet.ciiva.com/30174/159chpreztr-30174252.pdf?src-supplier=Onlinecomponents.com; ComponentLink4Description: https://datasheet.ciiva.com/30174/159chpreztr-30174252.pdf?src-supplier=Onlinecomponents.com; ComponentLink5URL: https://datasheet.ciiva.com/9122/chpreztr-9122814.pdf?src-supplier=Avnet; ComponentLink5Description: https://datasheet.ciiva.com/9122/chpreztr-9122814.pdf?src-supplier=Avnet; ComponentLink6URL: https://datasheet.ciiva.com/22713/691949-22713272.pdf?src-supplier=Element14; ComponentLink6Description: https://datasheet.ciiva.com/22713/691949-22713272.pdf?src-supplier=Element14; ComponentLink7URL: https://datasheet.ciiva.com/6560/chpreztr-6560075.pdf?src-supplier=Digi-Key; ComponentLink7Description: https://datasheet.ciiva.com/6560/chpreztr-6560075.pdf?src-supplier=Digi-Key; Supplier Part Number 1: CR0805-JW-472ELF
R*#2 = R100-0805FTK: as R514 on sheet Balancing; Supplier 1: Arrow Electronics; Manufacturer Part Number 1: CR0805-FX-1000ELF; RoHS: Yes; Category: Chip SMD Resistors; Stock 1: 49802; Pricing 1: 1=0,05840, 10=0,03430, 25=0,01780, 100=0,00750, 250=0,00560, 500=0,00490, 3000=0,00470 (USD); Mount: Surface Mount; Case/Package: 0805; Number of Pins: 2; Contact Plating: Tin; Case Code (Imperial): 0805; Case Code (Metric): 2012; Min Operating Temperature: -55°C; Max Operating Temperature: 155°C; Tolerance: 1%; Resistor Type: Thick Film; Temperature Coefficient: 100ppm/°C; Packaging: Tape and Reel; Package Quantity: 1; Termination: SMD/SMT; Number of Terminations: 2; Max Power Dissipation: 125mW; Voltage Rating (DC): 150V; Features: Moisture Resistant; Series: CR0805; Resistance Tolerance: 1%; Construction: Rectangular; Technology: THICK FILM; Length: 2mm; Width: 1.25mm; Height: 0.5mm; Depth: 1.25mm; Thickness: 508um; Radiation Hardening: No; REACH SVHC: No SVHC; Military Standard: Not; RoHS Compliant: Yes; ComponentLink1URL: https://datasheet.ciiva.com/11809/0900766b80fcdb72-11809178.pdf?src-supplier=RSComponents; ComponentLink1Description: https://datasheet.ciiva.com/11809/0900766b80fcdb72-11809178.pdf?src-supplier=RSComponents; ComponentLink2URL: https://datasheet.ciiva.com/6547/chpreztr-6547413.pdf?src-supplier=Digi-Key; ComponentLink2Description: https://datasheet.ciiva.com/6547/chpreztr-6547413.pdf?src-supplier=Digi-Key; ComponentLink3URL: https://datasheet.ciiva.com/6547/chpreztr-6547414.pdf?src-supplier=Digi-Key; ComponentLink3Description: https://datasheet.ciiva.com/6547/chpreztr-6547414.pdf?src-supplier=Digi-Key; ComponentLink4URL: https://datasheet.ciiva.com/6547/chpreztr-6547415.pdf?src-supplier=Digi-Key; ComponentLink4Description: https://datasheet.ciiva.com/6547/chpreztr-6547415.pdf?src-supplier=Digi-Key; ComponentLink5URL: https://datasheet.ciiva.com/9120/chpreztr-9120744.pdf?src-supplier=Avnet; ComponentLink5Description: https://datasheet.ciiva.com/9120/chpreztr-9120744.pdf?src-supplier=Avnet; Supplier Part Number 1: CR0805-FX-1000ELF
R?#2-R?#9 = R10k-0805FTK: BOURNS         CR0805-JW-103ELF            Surface Mount Chip Resistor, Thick Film, CR Series, 10 kohm, 125 mW,  5%, 150 V; Temperature Coefficient: 200ppm/°C; Power Rating: 125mW; Voltage Rating: 150V; Voltage Rating (DC): 100V; .Creator: DR; Supplier 1: Arrow Electronics; Manufacturer 1: Bourns; Manufacturer Part Number 1: CR0805-JW-103ELF; RoHS: Yes; Category: Chip SMD Resistors; Stock 1: 57566; Pricing 1: 1=0,05790, 10=0,01540, 25=0,01340, 100=0,00340 (USD); Mount: Surface Mount; Case/Package: 0805; Number of Pins: 2; Contact Plating: Tin; Case Code (Metric): 2012; Case Code (Imperial): 0805; Min Operating Temperature: -55°C; Max Operating Temperature: 155°C; Tolerance: 5%; Resistor Type: Thick Film; Package Quantity: 1; Packaging: Tape and Reel; Number of Terminations: 2; Termination: SMD/SMT; Max Power Dissipation: 125mW; Features: Moisture Resistant; Series: CR0805; Construction: Rectangular; Resistance Tolerance: 5%; Technology: THICK FILM; Length: 2mm; Width: 1.25mm; Height: 0.5mm; Depth: 1.25mm; Thickness: 508um; Radiation Hardening: No; REACH SVHC: No SVHC; Military Standard: Not; RoHS Compliant: Yes; ComponentLink1URL: https://datasheet.ciiva.com/11821/0900766b80fcdb72-11821135.pdf?src-supplier=RSComponents; ComponentLink1Description: https://datasheet.ciiva.com/11821/0900766b80fcdb72-11821135.pdf?src-supplier=RSComponents; ComponentLink2URL: https://datasheet.ciiva.com/9122/chpreztr-9122374.pdf?src-supplier=Avnet; ComponentLink2Description: https://datasheet.ciiva.com/9122/chpreztr-9122374.pdf?src-supplier=Avnet; ComponentLink3URL: https://datasheet.ciiva.com/22693/1902866-22693254.pdf?src-supplier=Element14; ComponentLink3Description: https://datasheet.ciiva.com/22693/1902866-22693254.pdf?src-supplier=Element14; ComponentLink4URL: https://datasheet.ciiva.com/7986/691949-7986187.pdf?src-supplier=Element14; ComponentLink4Description: https://datasheet.ciiva.com/7986/691949-7986187.pdf?src-supplier=Element14; ComponentLink5URL: https://datasheet.ciiva.com/30065/159chpreztr-30065976.pdf?src-supplier=Onlinecomponents.com; ComponentLink5Description: https://datasheet.ciiva.com/30065/159chpreztr-30065976.pdf?src-supplier=Onlinecomponents.com; ComponentLink6URL: https://datasheet.ciiva.com/16783/70154685-16783482.pdf?src-supplier=Allied+Electronics; ComponentLink6Description: https://datasheet.ciiva.com/16783/70154685-16783482.pdf?src-supplier=Allied+Electronics; ComponentLink7URL: https://datasheet.ciiva.com/5548/chpreztr-5548491.pdf?src-supplier=Mouser; ComponentLink7Description: https://datasheet.ciiva.com/5548/chpreztr-5548491.pdf?src-supplier=Mouser; ComponentLink8URL: https://datasheet.ciiva.com/6559/chpreztr-6559900.pdf?src-supplier=Digi-Key; ComponentLink8Description: https://datasheet.ciiva.com/6559/chpreztr-6559900.pdf?src-supplier=Digi-Key; ComponentLink9URL: https://datasheet.ciiva.com/6559/chpreztr-6559901.pdf?src-supplier=Digi-Key; ComponentLink9Description: https://datasheet.ciiva.com/6559/chpreztr-6559901.pdf?src-supplier=Digi-Key; ComponentLink10URL: https://datasheet.ciiva.com/7985/1856384-7985869.pdf?src-supplier=Element14; ComponentLink10Description: https://datasheet.ciiva.com/7985/1856384-7985869.pdf?src-supplier=Element14; ComponentLink11URL: https://datasheet.ciiva.com/48692/001055517-da-01-en-smd-wid-cr0805-jw-103elf-10k-ohm-1-8w-48692118.pdf?src-supplier=Conrad; ComponentLink11Description: https://datasheet.ciiva.com/48692/001055517-da-01-en-smd-wid-cr0805-jw-103elf-10k-ohm-1-8w-48692118.pdf?src-supplier=Conrad; Supplier Part Number 1: CR0805-JW-103ELF
TP?#1-TP?#10 = TestPoint: Test Point 1x1 mm; .Creator: GP; Category: TestPoint; .PCBcheck: GP; .SCHcheck: GP
U* = U_LTC1380GN

## Nets that join several sheets
+5_SLAVE: Balancing (C?#1.2 U1.37), Temperatures (13 pins)
C0: Balancing (11 pins), Temperatures (15 pins)